# Altium schematic sheet Hardware Tutorial - Inputs.SchDoc: Hardware Tutorial - Inputs
size B; Organization: Midnight Sun Solar Rayce Car Team; Address1: University of Waterloo; Address2: 200 University Ave W; Address3: Waterloo, ON, Canada; Address4: N2L 3E9; Website: www.uwmidsun.com; ProjectName: ProjectName
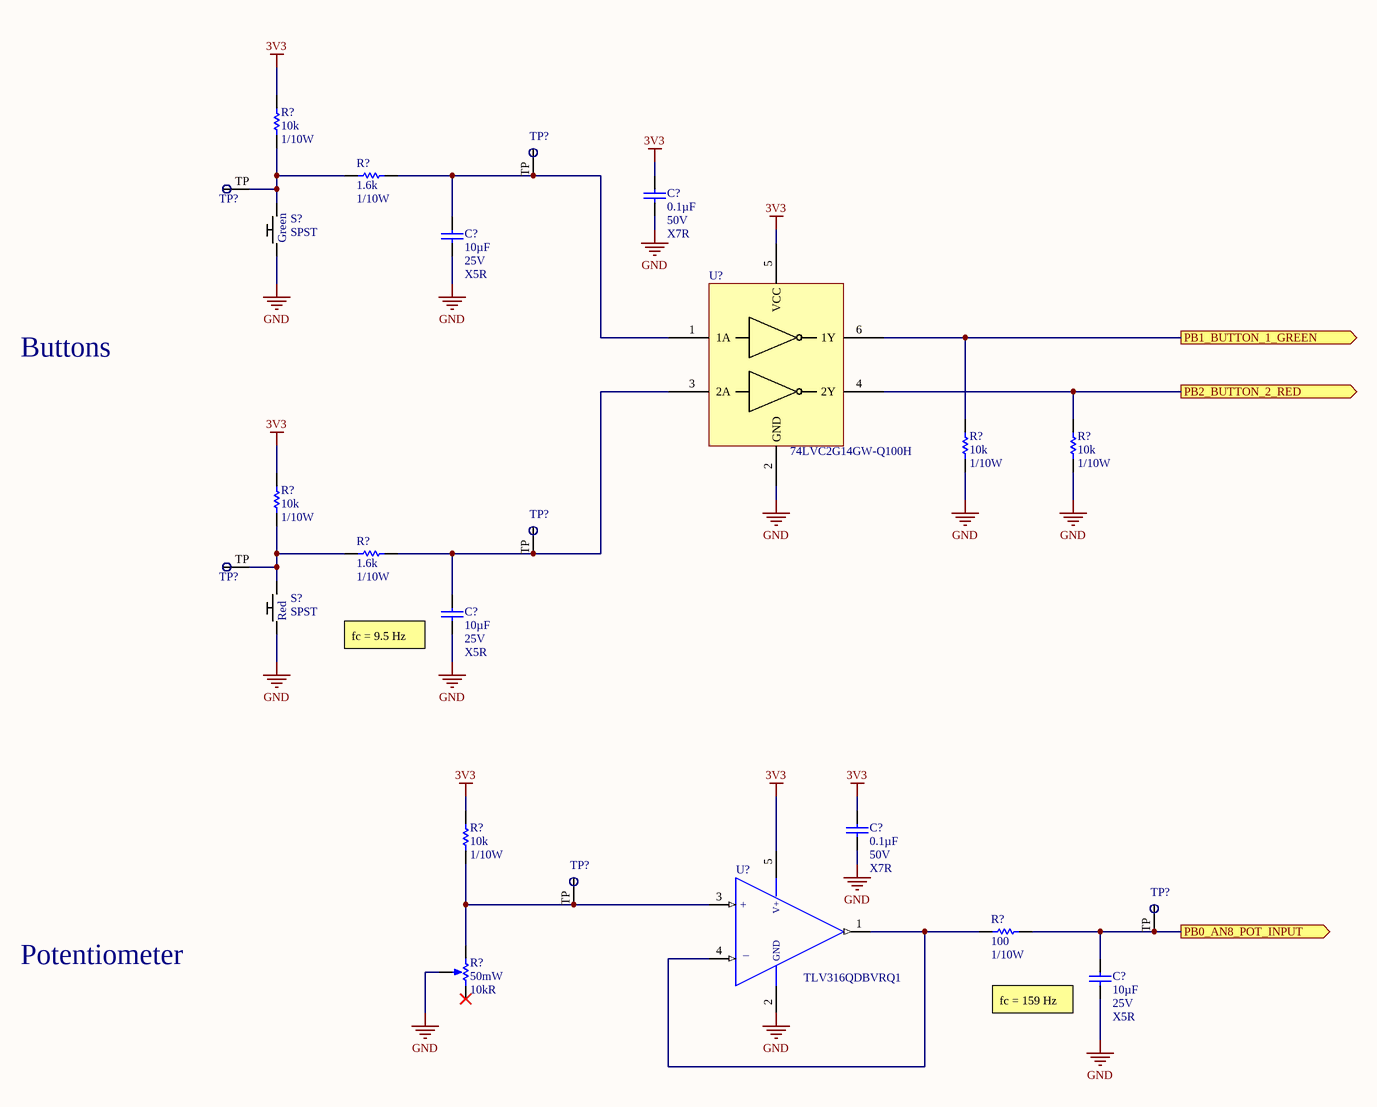
[diagram p0: Hardware Tutorial - Inputs.SchDoc]

## Parts
(Parts that share a designator on the sheet are numbered #1, #2 ... from top to bottom, then left to right.)
C?#1  Capacitance: 0.1µF  Voltage: 50V  Temperature Coefficient: X7R  [CAP, 0603]  (hidden comment: CAP CER 0.1UF 50V 10% X7R 0603)
C?#2  Capacitance: 10µF  Voltage: 25V  Temperature Coefficient: X5R  [CAP, 0603]  (hidden comment: CAP CER 10uF 25V 20% X5R 0603)
C?#3  Capacitance: 10µF  Voltage: 25V  Temperature Coefficient: X5R  [CAP, 0603]  (hidden comment: CAP CER 10uF 25V 20% X5R 0603)
C?#4  Capacitance: 0.1µF  Voltage: 50V  Temperature Coefficient: X7R  [CAP, 0603]  (hidden comment: CAP CER 0.1UF 50V 10% X7R 0603)
C?#5  Capacitance: 10µF  Voltage: 25V  Temperature Coefficient: X5R  [CAP, 0603]  (hidden comment: CAP CER 10uF 25V 20% X5R 0603)
R?#1  Resistance: 10k  Power: 1/10W  [RES, 0603]  (hidden comment: RES 10K OHM 1% 1/10W 0603)
R?#2  Resistance: 1.6k  Power Rating: 1/10W  [RES, 0603]  (hidden comment: RES 1.6K OHM 1% 1/10W 0603)
R?#3  Resistance: 10k  Power: 1/10W  [RES, 0603]  (hidden comment: RES 10K OHM 1% 1/10W 0603)
R?#4  Resistance: 10k  Power: 1/10W  [RES, 0603]  (hidden comment: RES 10K OHM 1% 1/10W 0603)
R?#5  Resistance: 10k  Power: 1/10W  [RES, 0603]  (hidden comment: RES 10K OHM 1% 1/10W 0603)
R?#6  Resistance: 1.6k  Power Rating: 1/10W  [RES, 0603]  (hidden comment: RES 1.6K OHM 1% 1/10W 0603)
R?#7  Resistance: 10k  Power: 1/10W  [RES, 0603]  (hidden comment: RES 10K OHM 1% 1/10W 0603)
R?#8  Resistance: 100  Power: 1/10W  [RES, 0603]  (hidden comment: RES 100 OHM 1% 1/10W 0603)
R?#9  Max Power Dissipation: 50mW  Resistance: 10kR  [POT 10K 20% 1/20W THROUGH HOLE]  (hidden comment: POT 10K OHM 20% 1/20W THROUGH HOLE)
S?#1  SPST  [SW SPST D6 SERIES GREEN]
S?#2  SPST  [SW SPST D6 SERIES RED]
TP?#1  Test Point  [Test Point]  (value not drawn)  (no BOM)
TP?#2  Test Point  [Test Point]  (value not drawn)  (no BOM)
TP?#3  Test Point  [Test Point]  (value not drawn)  (no BOM)
TP?#4  Test Point  [Test Point]  (value not drawn)  (no BOM)
TP?#5  Test Point  [Test Point]  (value not drawn)  (no BOM)
TP?#6  Test Point  [Test Point]  (value not drawn)  (no BOM)
U?#1  Manufacturer Part Number 1: 74LVC2G14GW-Q100H  [IC INVERTER SCHMITT 2CH 6-TSSOP]  (hidden comment: IC INVERTER SCHMITT 2CH 6-TSSOP)
U?#2  Manufacturer Part Number 1: TLV316QDBVRQ1  [IC OP AMP GP RR 10MHZ SOT-23-5]  (hidden comment: IC OP AMP GEN PURPOSE RR 10MHZ SOT-23-5)

## Ports
PB0_AN8_POT_INPUT (out), PB1_BUTTON_1_GREEN (out), PB2_BUTTON_2_RED (out)

## Nets
3V3: C?#1.1 C?#4.1 R?#1.1 R?#5.1 R?#7.1 U?#1.5(VCC) U?#2.5(VDD)
GND: C?#1.2 C?#2.2 C?#3.2 C?#4.2 C?#5.2 R?#3.2 R?#4.2 R?#9.2(TAP) S?#1.1 S?#2.1 U?#1.2(GND) U?#2.2(VSS)
PB0_AN8_POT_INPUT: C?#5.1 R?#8.2 TP?#6.TP ; port PB0_AN8_POT_INPUT
PB1_BUTTON_1_GREEN: R?#3.1 U?#1.6(1Y) ; port PB1_BUTTON_1_GREEN
PB2_BUTTON_2_RED: R?#4.1 U?#1.4(2Y) ; port PB2_BUTTON_2_RED
NetC?#2_1: C?#2.1 R?#2.2 TP?#2.TP U?#1.1(1A)
NetC?#3_1: C?#3.1 R?#6.2 TP?#4.TP U?#1.3(2A)
NetR?#1_2: R?#1.2 R?#2.1 S?#1.2 TP?#1.TP
NetR?#5_2: R?#5.2 R?#6.1 S?#2.2 TP?#3.TP
NetR?#7_2: R?#7.2 R?#9.1(TOP) TP?#5.TP U?#2.3(+IN)
NetR?#8_1: R?#8.1 U?#2.1(OUTPUT) U?#2.4(-IN)

Not connected (* = marked no-connect by the designer): R?#9 3(BOT)*

## Notes on the sheet
- Buttons
- (near C?#3) fc = 9.5 Hz
- Potentiometer
- (near C?#5) fc = 159 Hz
- PROJECT
- DOCUMENT
- DRAWN BY
- LAST MODIFIED
- PART NUMBER
- REVISION
- SHEET
- VARIANT
- OF
- Engineering 5 - 1002
  University of Waterloo
  (519) 888-4567 x32978
  hardware@uwmidsun.com
- (in symbol IC OP AMP GEN PURPOSE RR 10MHZ SOT-23-5) V+; +; GND; _

## Library data of the parts
C?#1 C?#4 = CAP CER 0.1UF 50V 10% X7R 0603: 0.10µF ±10% 50V Ceramic Capacitor X7R 0603 (1608 Metric); Manufacturer 1: AVX Corporation; Manufacturer Part Number 1: 06035C104KAT2A; Supplier 1: Digi-Key; Supplier Part Number 1: 478-5052-1-ND; Packaging: Cut Tape (CT); Part Status: Active; Operating Temperature: -55°C ~ 125°C; Ratings: -; Mounting Type: Surface Mount, MLCC; Package / Case: 0603 (1608 Metric); Size / Dimension: 0.063" L x 0.032" W (1.60mm x 0.81mm); Height - Seated (Max): -; Thickness (Max): 0.035" (0.90mm); Lead Spacing: -; Lead Style: -; ComponentLink1URL: http://datasheets.avx.com/X7RDielectric.pdf; ComponentLink1Description: http://datasheets.avx.com/X7RDielectric.pdf; Tolerance: ±10%
C?#2 C?#3 C?#5 = CAP CER 10uF 25V 20% X5R 0603: 10µF ±20% 25V Ceramic Capacitor X5R 0603 (1608 Metric); Manufacturer 1: Murata Electronics North America; Manufacturer Part Number 1: GRM188R61E106MA73D; Supplier 1: Digi-Key; Supplier Part Number 1: 490-7202-1-ND; Packaging: Cut Tape (CT); Part Status: Active; Operating Temperature: -55°C ~ 85°C; Ratings: -; Mounting Type: Surface Mount, MLCC; Package / Case: 0603 (1608 Metric); Size / Dimension: 0.063" L x 0.031" W (1.60mm x 0.80mm); Height - Seated (Max): -; Thickness (Max): 0.031" (0.80mm); Lead Spacing: -; Lead Style: -; ComponentLink1URL: http://www.murata.com/~/media/webrenewal/support/library/catalog/products/capacitor/mlcc/c02e.ashx; ComponentLink1Description: http://www.murata.com/~/media/webrenewal/support/library/catalog/products/capacitor/mlcc/c02e.ashx; Tolerance: ±20%
R?#1 R?#3-R?#5 R?#7 = RES 10K OHM 1% 1/10W 0603: RES SMD 10K OHM 1% 1/10W 0603; Manufacturer 1: Yageo; Manufacturer Part Number 1: RC0603FR-0710KL; Temperature Coefficient: ±100ppm/°C; Supplier 1: Digi-Key; Supplier Part Number 1: 311-10.0KHRCT-ND; Packaging: Cut Tape (CT); Part Status: Active; Composition: Thick Film; Operating Temperature: -55°C ~ 155°C; Package / Case: 0603 (1608 Metric); Supplier Device Package: 0603; Size / Dimension: 0.063" L x 0.031" W (1.60mm x 0.80mm); Height - Seated (Max): 0.022" (0.55mm); Failure Rate: -; ComponentLink1URL: http://www.yageo.com/documents/recent/PYu-RC_Group_51_RoHS_L_7.pdf; ComponentLink1Description: http://www.yageo.com/documents/recent/PYu-RC_Group_51_RoHS_L_7.pdf; Tolerance: ±1%
R?#2 R?#6 = RES 1.6K OHM 1% 1/10W 0603: 1.6 kOhms ±1% 0.1W, 1/10W Chip Resistor 0603 (1608 Metric) Moisture Resistant Thick Film; Manufacturer: Yageo; Manufacturer Part Number: RC0603FR-071K6L; Voltage Rating: 50V; Temperature Coefficient: 100ppm/°C; Working Voltage: 75V; Supplier 1: Digi-Key; Stock 1: 189550; Pricing 1: 1=0.1, 10=0.015, 100=0.006, 1000=0.0027, 2500=0.0023 (USD); Case/Package: 0603; Case Code (Imperial): 0603; Case Code (Metric): 1608; Min Operating Temperature: -55°C; Max Operating Temperature: 155°C; Tolerance: 1%; Packaging: Tape and Reel; Termination: SMD/SMT; Composition: Thick Film; Military Standard: Not; Voltage Rating (DC): 50V; Number of Terminations: 2; Length: 1.6mm; Depth: 0.8mm; Lead Free: Lead Free; ComponentLink1URL: http://components.arrow.com/part/dataview/0323_00200779; ComponentLink1Description: http://components.arrow.com/part/dataview/0323_00200779; ComponentLink2URL: http://www.yageo.com.tw/exep/pages/download/literatures/PYu-R_INT-thick_7.pdf; ComponentLink2Description: http://www.yageo.com.tw/exep/pages/download/literatures/PYu-R_INT-thick_7.pdf; ComponentLink3URL: http://www.mouser.com/ds/2/447/RC0603-272842.pdf; ComponentLink3Description: http://www.mouser.com/ds/2/447/RC0603-272842.pdf; ComponentLink4URL: http://www.yageo.com/documents/recent/PYu-RC0603_51_RoHS_L_v5.pdf; ComponentLink4Description: http://www.yageo.com/documents/recent/PYu-RC0603_51_RoHS_L_v5.pdf; Supplier Part Number 1: 311-1.60KHRCT-ND
R?#8 = RES 100 OHM 1% 1/10W 0603: 100 Ohm ±1% 0.1W, 1/10W Chip Resistor 0603 (1608 Metric) Moisture Resistant Thick Film; Manufacturer 1: Yageo; Manufacturer Part Number 1: RC0603FR-07100RL; Temperature Coefficient: ±100ppm/°C; Supplier 1: Digi-Key; Supplier Part Number 1: 311-100HRCT-ND; Packaging: Cut Tape (CT); Part Status: Active; Composition: Thick Film; Operating Temperature: -55°C ~ 155°C; Package / Case: 0603 (1608 Metric); Supplier Device Package: 0603; Size / Dimension: 0.063" L x 0.031" W (1.60mm x 0.80mm); Height - Seated (Max): 0.022" (0.55mm); Failure Rate: -; ComponentLink1URL: http://www.yageo.com/documents/recent/PYu-RC_Group_51_RoHS_L_7.pdf; ComponentLink1Description: http://www.yageo.com/documents/recent/PYu-RC_Group_51_RoHS_L_7.pdf; Tolerance: ±1%
R?#9 = POT 10K OHM 20% 1/20W THROUGH HOLE: 10k Ohm 1 Gang Linear Through Hole, Snap In Potentiometer None 1 Turn Carbon 0.05W, 1/20W PC Pins, Board Locks; Manufacturer 1: Bourns; Manufacturer Part Number 1: PTV09A-4015F-B103; Number of Gangs: 1; Actuator Length: 0.591inch; Actuator Diameter: 0.236inch; Supplier 1: Digi-Key; Stock 1: 744; Pricing 1: 1=0.83000, 10=0.74400, 25=0.67200, 50=0.64800, 100=0.61200, 300=0.58800, 500=0.55200, 1000=0.45600, 5000=0.37200 (USD); RoHS: Yes; Mount: Through Hole; Min Operating Temperature: -10°C; Max Operating Temperature: 50°C; Packaging: Bulk; Tolerance: 20%; Power Rating: 50mW; Package Quantity: 100; Composition: Carbon; Taper: Linear; Termination: PCB; Number of Turns: 1; Military Standard: Not; Type: Potentiometer; Length: 11.4mm; Depth: 12.5mm; Radiation Hardening: No; REACH SVHC: No SVHC; ComponentLink1URL: https://datasheet.ciiva.com/8701/ptv09-8701798.pdf?src-supplier=Avnet; ComponentLink1Description: https://datasheet.ciiva.com/8701/ptv09-8701798.pdf?src-supplier=Avnet; ComponentLink2URL: https://datasheet.ciiva.com/4991/ptv09-4991849.pdf?src-supplier=Mouser; ComponentLink2Description: https://datasheet.ciiva.com/4991/ptv09-4991849.pdf?src-supplier=Mouser; ComponentLink3URL: https://datasheet.ciiva.com/6249/ptv09-6249515.pdf?src-supplier=Digi-Key; ComponentLink3Description: https://datasheet.ciiva.com/6249/ptv09-6249515.pdf?src-supplier=Digi-Key; Supplier Part Number 1: PTV09A-4015F-B103-ND
S?#1 = SW SPST-NO 0.1A 32V D6 Series Green: Pushbutton Switch SPST-NO Keyswitch Through Hole D6 Series Green; Manufacturer: C&K; Manufacturer Part Number: D6R50 F1 LFS; Switch Function: Off-Mom; Current Rating: 100mA (DC); Voltage Rating - DC: 32V; Actuator Type: Round, Button; Electrical Life: 250,000 Cycles; Supplier 1: Digi-Key; RoHS: RoHS Compliant; Category: Switches; Stock 1: 3742; Pricing 1: 1=1.73, 10=1.607, 25=1.5308, 50=1.454, 100=1.4158, 250=1.37756, 500=1.30102, 1000=1.22448, 5000=1.03316 (CAD); Packaging: Bulk; Part Status: Active; Type: Keyswitch; Circuit: SPST-NO; Voltage Rating - AC: -; Color - Actuator/Cap: Green; Illumination Type, Color: -; Illumination Voltage (Nominal): -; Mounting Type: Through Hole; Termination Style: PC Pin; Ingress Protection: -; Features: Tactile Feedback; Panel Cutout Dimensions: -; Operating Temperature: -20°C ~ 85°C; Mechanical Life: -; ComponentLink1URL: http://www.ckswitches.com/media/1341/d6.pdf; ComponentLink1Description: http://www.ckswitches.com/media/1341/d6.pdf; Supplier Part Number 1: 401-1976-ND
S?#2 = SW SPST-NO 0.1A 32V D6 Series Red: Pushbutton Switch SPST-NO Keyswitch Through Hole D6 Series Red; Manufacturer: C&K; Manufacturer Part Number: D6R40 F1 LFS; Switch Function: Off-Mom; Current Rating: 100mA (DC); Voltage Rating - DC: 32V; Actuator Type: Round, Button; Electrical Life: 250,000 Cycles; Supplier 1: Digi-Key; RoHS: RoHS Compliant; Category: Switches; Stock 1: 4872; Pricing 1: 1=1.73, 10=1.607, 25=1.5308, 50=1.454, 100=1.4158, 250=1.37756, 500=1.30102, 1000=1.22448, 5000=1.03316 (CAD); Packaging: Bulk; Part Status: Active; Type: Keyswitch; Circuit: SPST-NO; Voltage Rating - AC: -; Color - Actuator/Cap: Red; Illumination Type, Color: -; Illumination Voltage (Nominal): -; Mounting Type: Through Hole; Termination Style: PC Pin; Ingress Protection: -; Features: Tactile Feedback; Panel Cutout Dimensions: -; Operating Temperature: -20°C ~ 85°C; Mechanical Life: -; ComponentLink1URL: http://www.ckswitches.com/media/1341/d6.pdf; ComponentLink1Description: http://www.ckswitches.com/media/1341/d6.pdf; Supplier Part Number 1: 401-1975-ND
U?#1 = IC INVERTER SCHMITT 2CH 6-TSSOP: Manufacturer 1: Nexperia; Supplier 1: Digi-Key; Stock 1: 12418; Pricing 1: 1=0.33000, 10=0.24300, 25=0.21240, 100=0.13740, 250=0.11372, 500=0.09100, 1000=0.06976 (USD); RoHS: No; ComponentLink1URL: https://assets.nexperia.com/documents/data-sheet/74LVC2G14_Q100.pdf?src-supplier=Digi-Key; ComponentLink1Description: https://assets.nexperia.com/documents/data-sheet/74LVC2G14_Q100.pdf?src-supplier=Digi-Key; Supplier Part Number 1: 1727-2072-1-ND
U?#2 = IC OP AMP GEN PURPOSE RR 10MHZ SOT-23-5: General Purpose Amplifier 1 Circuit Rail-to-Rail SOT-23-5; Manufacturer 1: Texas Instruments; Description 1: IC OP AMP GP RR 10MHZ 5-SOT-23; Number of Circuits: 1; Slew Rate: 6 V/µs; Current - Supply: 400µA; Current - Output / Channel: 50mA; Voltage - Supply, Single/Dual (±): 1.8 V ~ 5.5 V, ±0.9 V ~ 2.75 V; Supplier 1: Digi-Key; Supplier Part Number 1: 296-45323-1-ND; RoHS: RoHS Compliant; Category: Integrated Circuits (ICs); Stock 1: 1747; Pricing 1: 1=1.33, 10=1.185, 100=0.9234, 500=0.76276, 1000=0.60218 (CAD); Packaging: Cut Tape (CT); Part Status: Active; Amplifier Type: General Purpose; Output Type: Rail-to-Rail; -3db Bandwidth: -; Operating Temperature: -40°C ~ 125°C; Mounting Type: Surface Mount; Package / Case: SC-74A, SOT-753; Supplier Device Package: SOT-23-5; ComponentLink1URL: http://www.ti.com/lit/ds/symlink/tlv316-q1.pdf; ComponentLink1Description: http://www.ti.com/lit/ds/symlink/tlv316-q1.pdf